# EAGLE schematic T-Bone+Uart+Pulldown (EAGLE 6.6.0)
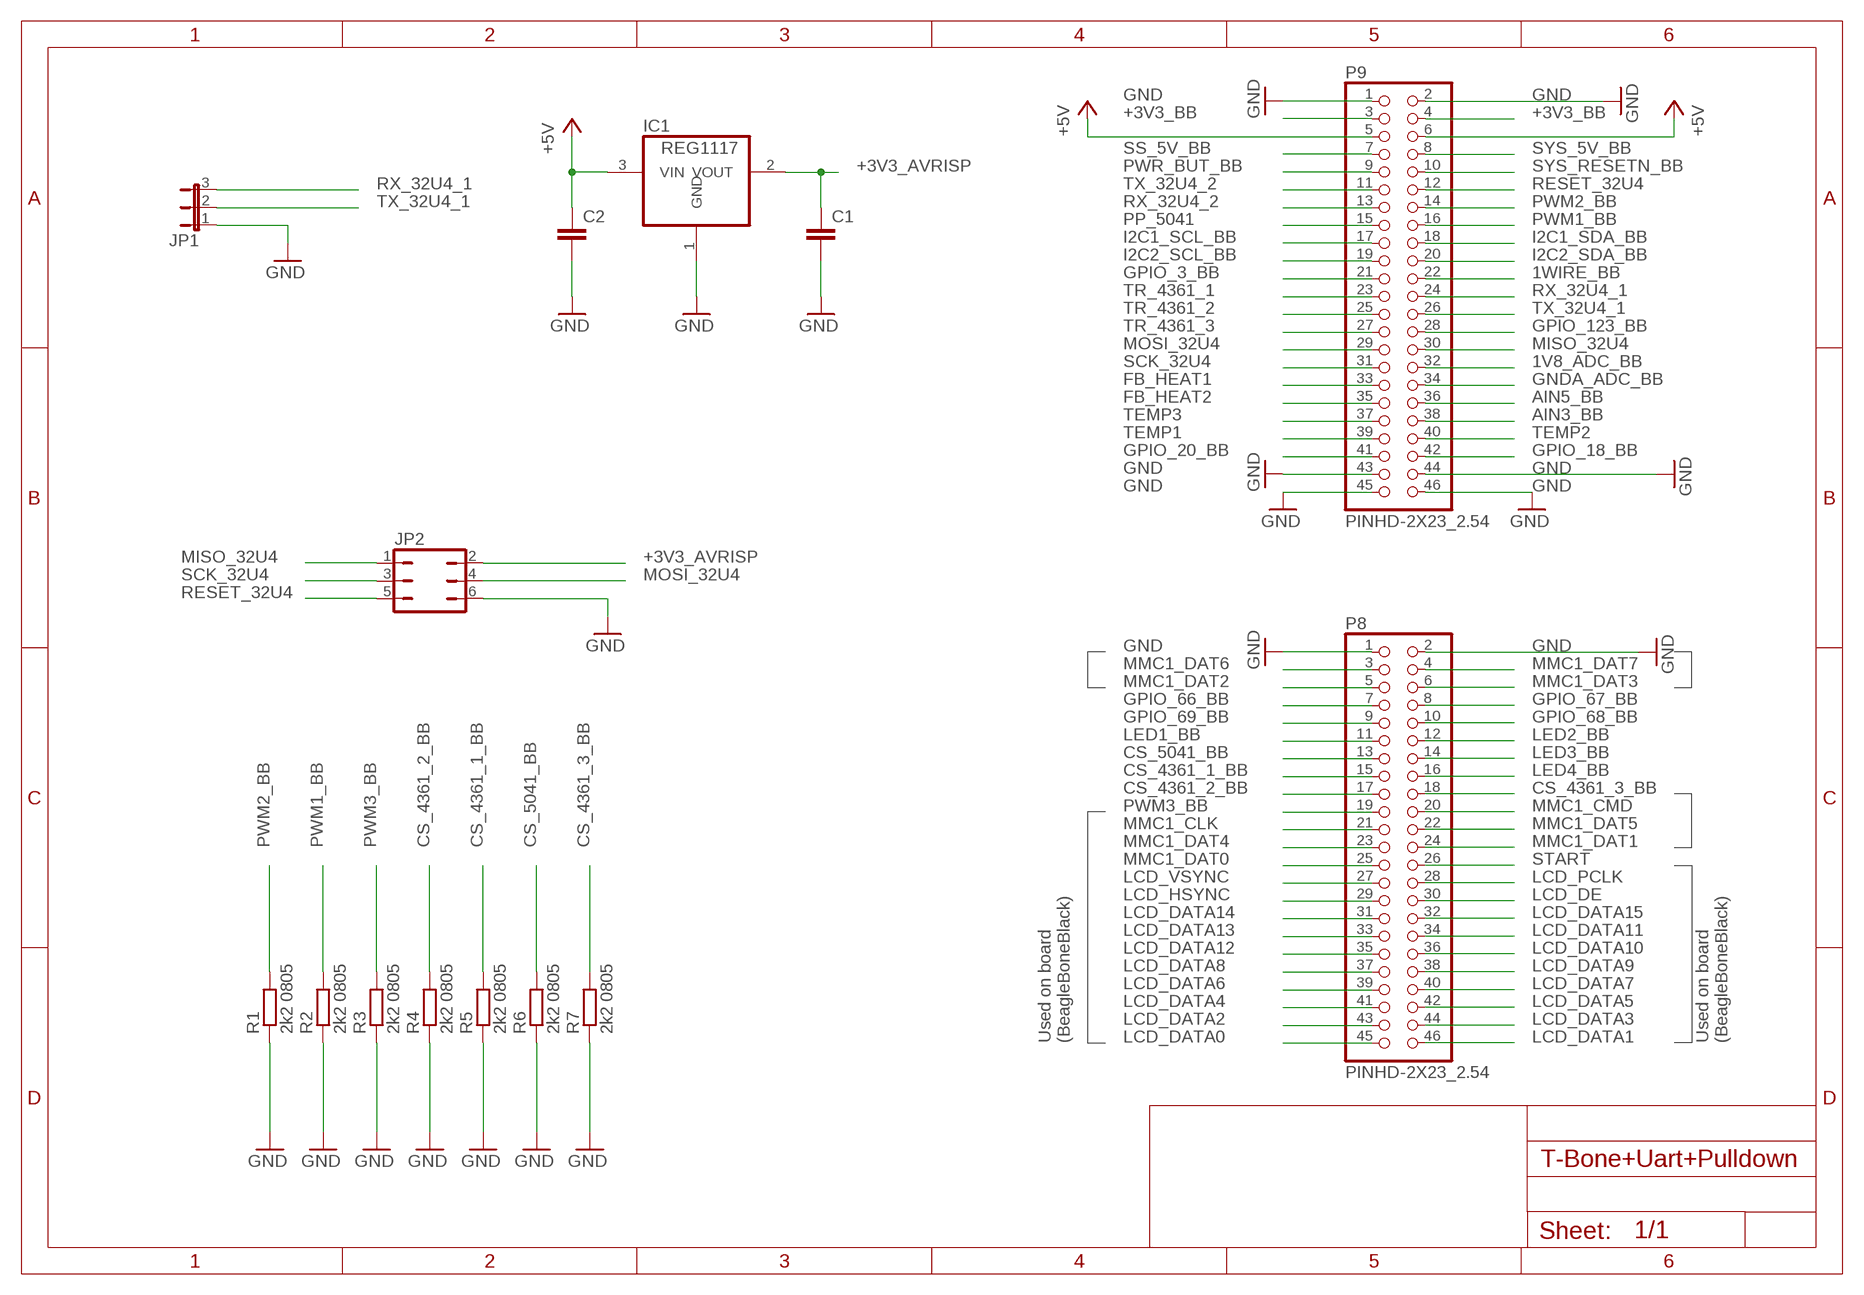
[diagram p0: schematic, sheet 1]

## Parts
C1  C-EUC0805  [C0805]
C2  C-EUC0805  [C0805]
IC1  REG1117  [SOT223]
JP1  JP2E  [JP2]
JP2  JP3Q  [JP3Q]
P8  PINHD-2X23_2.54  [2X23]
P9  PINHD-2X23_2.54  [2X23]
R1  2k2 0805  R-EU_R0805  [R0805]
R2  2k2 0805  R-EU_R0805  [R0805]
R3  2k2 0805  R-EU_R0805  [R0805]
R4  2k2 0805  R-EU_R0805  [R0805]
R5  2k2 0805  R-EU_R0805  [R0805]
R6  2k2 0805  R-EU_R0805  [R0805]
R7  2k2 0805  R-EU_R0805  [R0805]

## Nets
1V8_ADC_BB: P9.32
1WIRE_BB: P9.22
+3V3_AVRISP: C1.1 IC1.2(VOUT) JP2.2
+3V3_BB: P9.3 P9.4
+5V: C2.1 IC1.3(VIN) P9.5 P9.6
AIN3_BB: P9.38
AIN5_BB: P9.36
CS_4361_1_BB: P8.15 R5.2
CS_4361_2_BB: P8.17 R4.2
CS_4361_3_BB: P8.18 R7.2
CS_5041_BB: P8.13 R6.2
FB_HEAT1: P9.33
FB_HEAT2: P9.35
GND: C1.2 C2.2 IC1.1(GND) JP1.1 JP2.6 P8.1 P8.2 P9.1 P9.2 P9.43 P9.44 P9.45 P9.46 R1.1 R2.1 R3.1 R4.1 R5.1 R6.1 R7.1
GNDA_ADC_BB: P9.34
GPIO_3_BB: P9.21
GPIO_18_BB: P9.42
GPIO_20_BB: P9.41
GPIO_66_BB: P8.7
GPIO_67_BB: P8.8
GPIO_68_BB: P8.10
GPIO_69_BB: P8.9
GPIO_123_BB: P9.28
I2C1_SCL_BB: P9.17
I2C1_SDA_BB: P9.18
I2C2_SCL_BB: P9.19
I2C2_SDA_BB: P9.20
LCD_DATA0: P8.45
LCD_DATA1: P8.46
LCD_DATA2: P8.43
LCD_DATA3: P8.44
LCD_DATA4: P8.41
LCD_DATA5: P8.42
LCD_DATA6: P8.39
LCD_DATA7: P8.40
LCD_DATA8: P8.37
LCD_DATA9: P8.38
LCD_DATA10: P8.36
LCD_DATA11: P8.34
LCD_DATA12: P8.35
LCD_DATA13: P8.33
LCD_DATA14: P8.31
LCD_DATA15: P8.32
LCD_DE: P8.30
LCD_HSYNC: P8.29
LCD_PCLK: P8.28
LCD_VSYNC: P8.27
LED1_BB: P8.11
LED2_BB: P8.12
LED3_BB: P8.14
LED4_BB: P8.16
MISO_32U4: JP2.1 P9.30
MMC1_CLK: P8.21
MMC1_CMD: P8.20
MMC1_DAT0: P8.25
MMC1_DAT1: P8.24
MMC1_DAT2: P8.5
MMC1_DAT3: P8.6
MMC1_DAT4: P8.23
MMC1_DAT5: P8.22
MMC1_DAT6: P8.3
MMC1_DAT7: P8.4
MOSI_32U4: JP2.4 P9.29
PP_5041: P9.15
PWM1_BB: P9.16 R2.2
PWM2_BB: P9.14 R1.2
PWM3_BB: P8.19 R3.2
PWR_BUT_BB: P9.9
RESET_32U4: JP2.5 P9.12
RX_32U4_1: JP1.3 P9.24
RX_32U4_2: P9.13
SCK_32U4: JP2.3 P9.31
SS_5V_BB: P9.7
START: P8.26
SYS_5V_BB: P9.8
SYS_RESETN_BB: P9.10
TEMP1: P9.39
TEMP2: P9.40
TEMP3: P9.37
TR_4361_1: P9.23
TR_4361_2: P9.25
TR_4361_3: P9.27
TX_32U4_1: JP1.2 P9.26
TX_32U4_2: P9.11

## Notes on the sheet
- Used on board
  (BeagleBoneBlack)
- Used on board
  (BeagleBoneBlack)

## Library data of the parts
C1 C2 = rcl:C-EU: CAPACITOR, European symbol
IC1 = burr-brown:REG1117: 800mA and 1A Low Dropout (LDO) Positive Regulator 1.8V, 2.5V, 2.85V, 3.3V, 5V, and Adj; MPN: REG1117; OC_FARNELL: 1097566; OC_NEWARK: 14P6981
JP1 = jumper:JP2E: JUMPER
JP2 = jumper:JP3Q: JUMPER
P8 P9 = TMC_3D_Printer:PINHD-2X23: PIN HEADER
R1-R7 = rcl:R-EU_: RESISTOR, European symbol